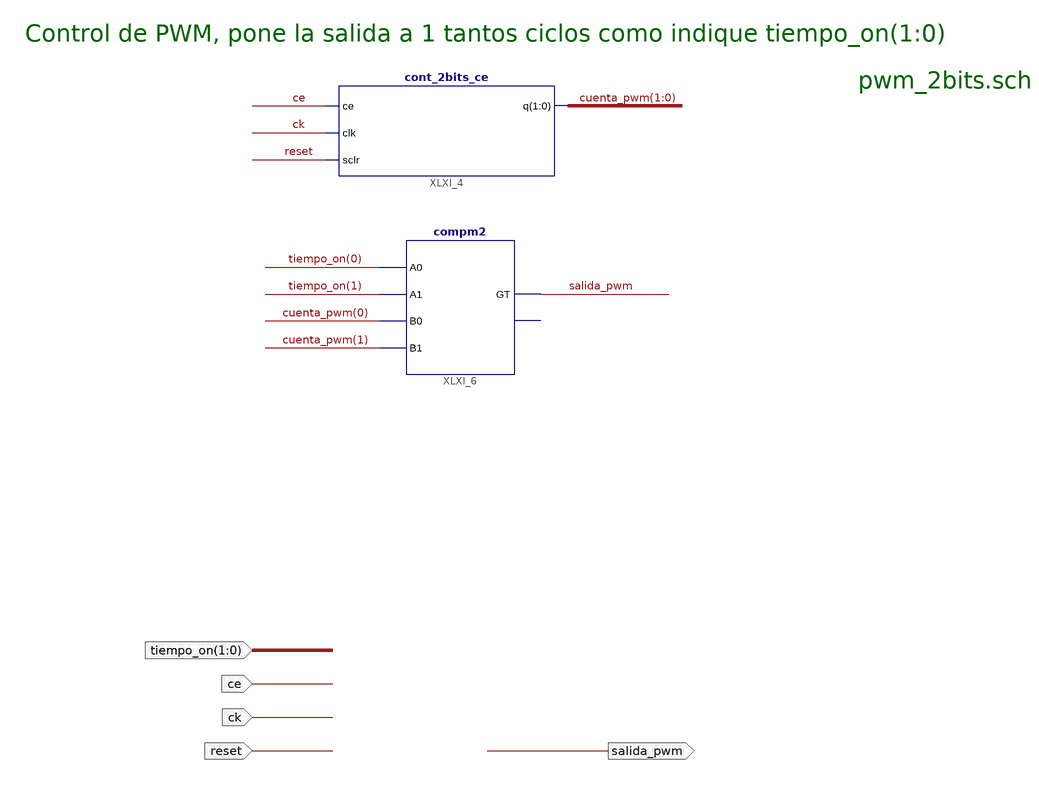
[diagram p0: schematic sheet 1]
// Xilinx ISE schematic pwm_2bits.sch (spartan6) as structural Verilog: 2 symbols, 5 ports
module pwm_2bits (
  input  ce,
  input  ck,
  input  reset,
  input  [1:0] tiempo_on,
  output salida_pwm
);

  wire [1:0] cuenta_pwm;

  cont_2bits_ce XLXI_4 (.q(cuenta_pwm), .ce(ce), .clk(ck), .sclr(reset));
  compm2 XLXI_6 (
    .A0(tiempo_on[0]), .A1(tiempo_on[1]), .B0(cuenta_pwm[0]), .B1(cuenta_pwm[1]), .GT(salida_pwm));  // open: LT

  // Notes on the sheet:
  //   Control de PWM, pone la salida a 1 tantos ciclos como indique tiempo_on(1:0)
  //   pwm_2bits.sch
endmodule
